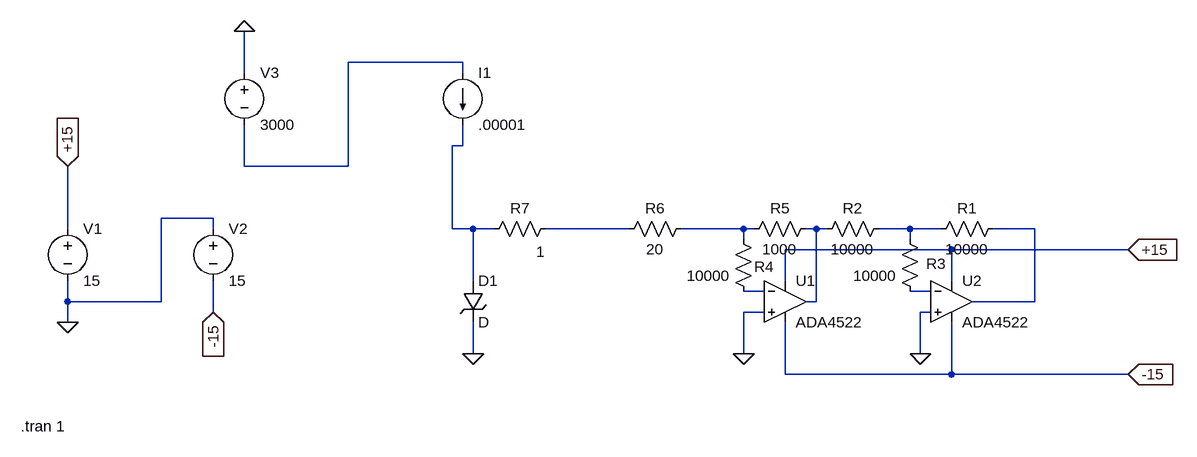
[diagram p0: schematic TRANSIMPEDANCE CURRENT SENSE.asc]
TRANSIMPEDANCE CURRENT SENSE.asc, the LTspice schematic file:
Version 4
SHEET 1 1124 680
WIRE 0 -512 -176 -512
WIRE -336 -496 -336 -560
WIRE 0 -496 0 -512
WIRE 0 -384 0 -416
WIRE 0 -384 -16 -384
WIRE -336 -352 -336 -416
WIRE -176 -352 -176 -512
WIRE -176 -352 -336 -352
WIRE -384 -272 -464 -272
WIRE -608 -256 -608 -352
WIRE -384 -256 -384 -272
WIRE -16 -256 -16 -384
WIRE 16 -256 -16 -256
WIRE 48 -256 16 -256
WIRE 256 -256 128 -256
WIRE 432 -256 336 -256
WIRE 448 -256 432 -256
WIRE 544 -256 528 -256
WIRE 560 -256 544 -256
WIRE 688 -256 640 -256
WIRE 736 -256 688 -256
WIRE 880 -256 816 -256
WIRE 432 -240 432 -256
WIRE 688 -240 688 -256
WIRE 752 -224 496 -224
WIRE 1024 -224 752 -224
WIRE 16 -176 16 -256
WIRE 496 -176 496 -224
WIRE 752 -176 752 -224
WIRE 464 -160 432 -160
WIRE 720 -160 688 -160
WIRE -608 -144 -608 -176
WIRE -464 -144 -464 -272
WIRE -464 -144 -608 -144
WIRE 544 -144 544 -256
WIRE 544 -144 528 -144
WIRE 880 -144 880 -256
WIRE 880 -144 784 -144
WIRE -384 -128 -384 -176
WIRE 464 -128 432 -128
WIRE 720 -128 704 -128
WIRE -608 -112 -608 -144
WIRE 16 -64 16 -112
WIRE 432 -64 432 -128
WIRE 704 -64 704 -128
WIRE 496 -32 496 -112
WIRE 752 -32 752 -112
WIRE 752 -32 496 -32
WIRE 1024 -32 752 -32
FLAG 704 -64 0
FLAG 432 -64 0
FLAG 16 -64 0
FLAG 1024 -224 +15
IOPIN 1024 -224 In
FLAG 1024 -32 -15
IOPIN 1024 -32 In
FLAG -608 -112 0
FLAG -608 -352 +15
IOPIN -608 -352 In
FLAG -384 -128 -15
IOPIN -384 -128 In
FLAG -336 -560 0
SYMBOL Opamps\\ADA4522 496 -208 R0
SYMATTR InstName U1
SYMBOL Opamps\\ADA4522 752 -208 R0
SYMATTR InstName U2
SYMBOL res 832 -272 R90
WINDOW 0 0 56 VBottom 2
WINDOW 3 32 56 VTop 2
SYMATTR InstName R1
SYMATTR Value 10000
SYMATTR SpiceLine tol=0.01
SYMBOL res 656 -272 R90
WINDOW 0 0 56 VBottom 2
WINDOW 3 32 56 VTop 2
SYMATTR InstName R2
SYMATTR Value 10000
SYMATTR SpiceLine tol=.01
SYMBOL res 704 -144 R180
WINDOW 0 -40 58 Left 2
WINDOW 3 36 40 Left 2
SYMATTR InstName R3
SYMATTR Value 10000
SYMATTR SpiceLine tol=.01
SYMBOL res 448 -144 R180
WINDOW 0 -31 54 Left 2
WINDOW 3 36 40 Left 2
SYMATTR InstName R4
SYMATTR Value 10000
SYMATTR SpiceLine tol=.01
SYMBOL res 544 -272 R90
WINDOW 0 0 56 VBottom 2
WINDOW 3 32 56 VTop 2
SYMATTR InstName R5
SYMATTR Value 1000
SYMATTR SpiceLine tol=.01
SYMBOL res 352 -272 R90
WINDOW 0 0 56 VBottom 2
WINDOW 3 32 56 VTop 2
SYMATTR InstName R6
SYMATTR Value 20
SYMBOL res 144 -272 R90
WINDOW 0 0 56 VBottom 2
WINDOW 3 36 24 VTop 2
SYMATTR InstName R7
SYMATTR Value 1
SYMATTR SpiceLine tol=.01
SYMBOL TVSdiode 0 -176 R0
SYMATTR InstName D1
SYMBOL voltage -608 -272 R0
WINDOW 123 0 0 Left 2
WINDOW 39 0 0 Left 2
SYMATTR InstName V1
SYMATTR Value 15
SYMBOL voltage -384 -272 R0
WINDOW 123 0 0 Left 2
WINDOW 39 0 0 Left 2
SYMATTR InstName V2
SYMATTR Value 15
SYMBOL current 0 -496 R0
WINDOW 123 0 0 Left 2
WINDOW 39 0 0 Left 2
SYMATTR InstName I1
SYMATTR Value .00001
SYMBOL voltage -336 -512 R0
WINDOW 123 0 0 Left 2
WINDOW 39 0 0 Left 2
SYMATTR InstName V3
SYMATTR Value 3000
TEXT -680 48 Left 2 !.tran 1

The netlist it stands for:
* TRANSIMPEDANCE CURRENT SENSE.asc
XU1 0 N008 +15 -15 N005 ADA4522  ; pins In+ In- V+ V- OUT
XU2 0 N009 +15 -15 N007 ADA4522  ; pins In+ In- V+ V- OUT
R1 N007 N006 10000 tol=0.01
R2 N006 N005 10000 tol=.01
R3 N009 N006 10000 tol=.01
R4 N008 N004 10000 tol=.01
R5 N005 N004 1000 tol=.01
R6 N004 N003 20
R7 N003 N002 1 tol=.01
D1 N002 0 D
V1 +15 0 15
V2 0 -15 15
I1 N001 N002 .00001
V3 0 N001 3000
.model D D
.lib standard.dio
.tran 1
.backanno
.end